# EAGLE board ESP32_BLDC_Motor_Driver (EAGLE 9.6.2)
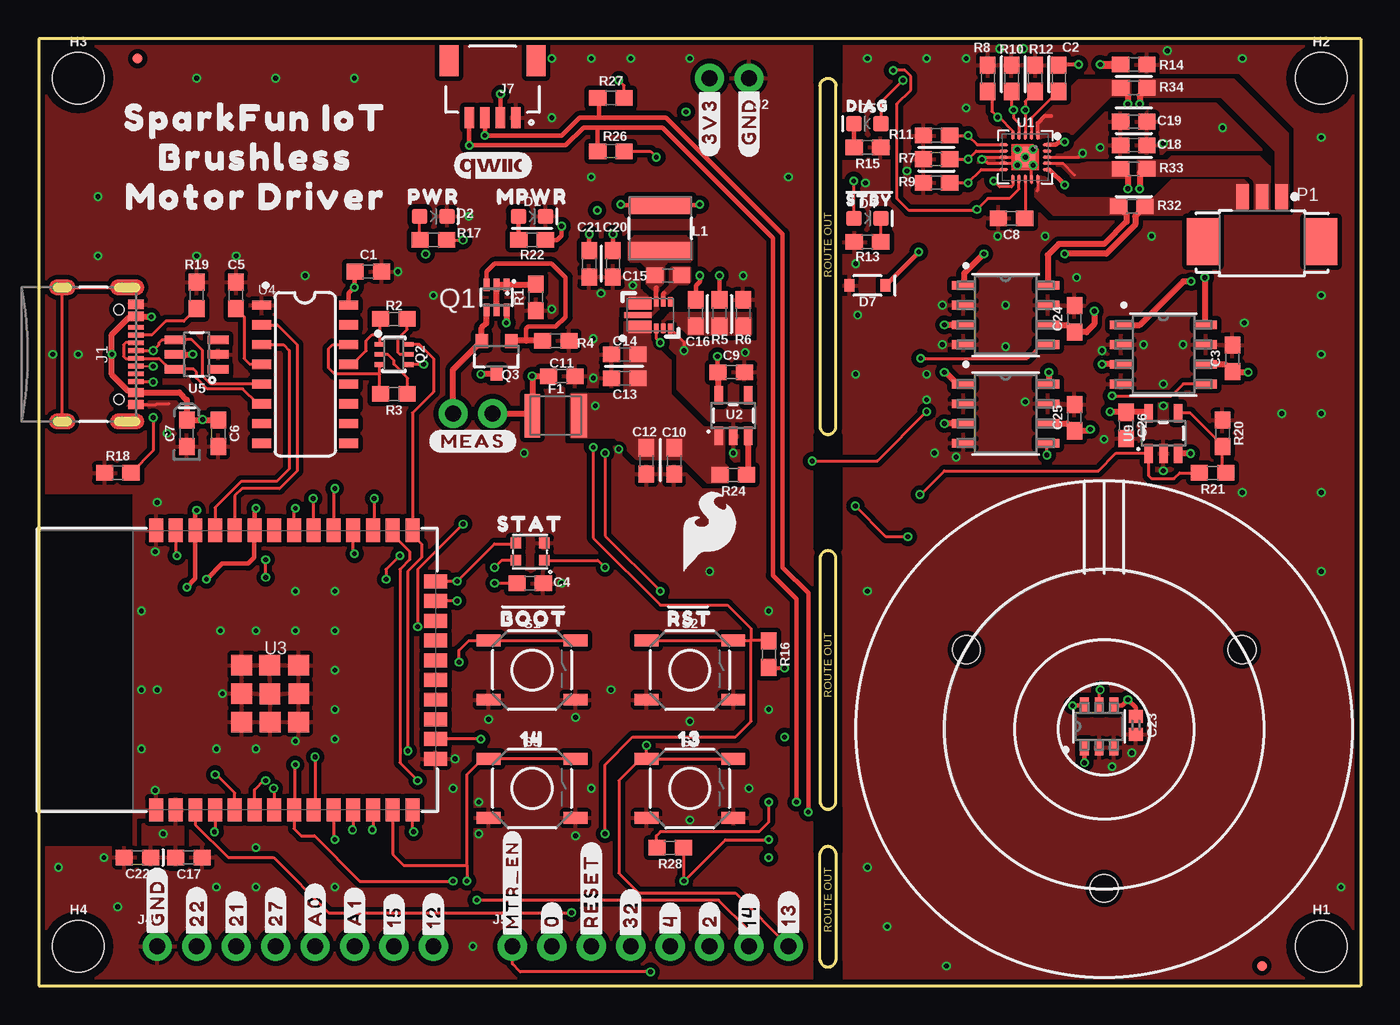
[diagram p1: board, top side]
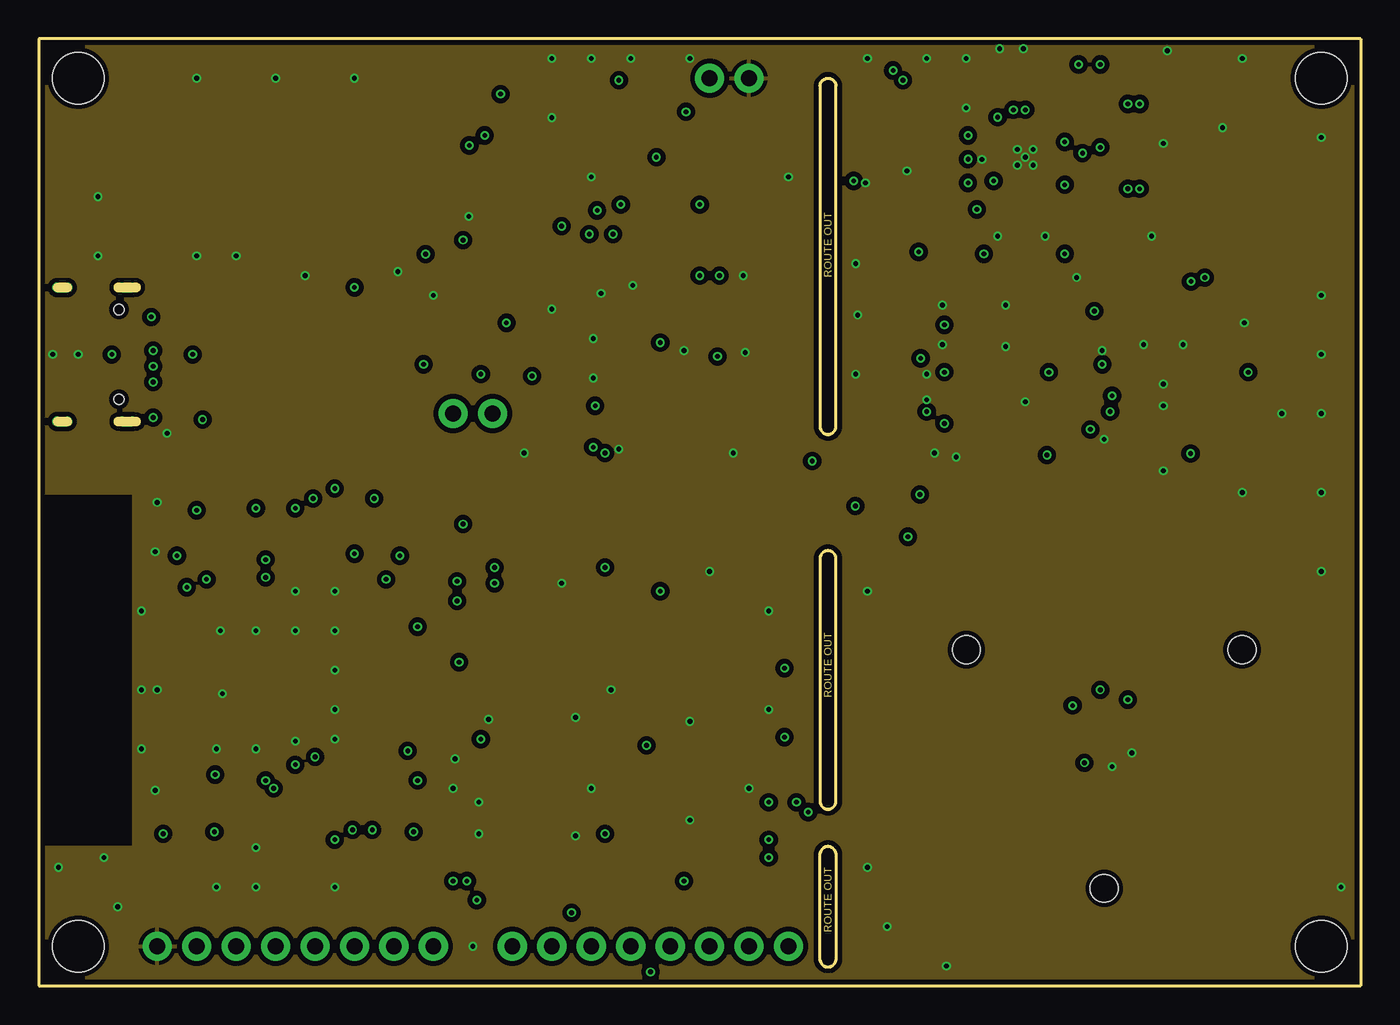
[diagram p2: board, inner layer Route2]
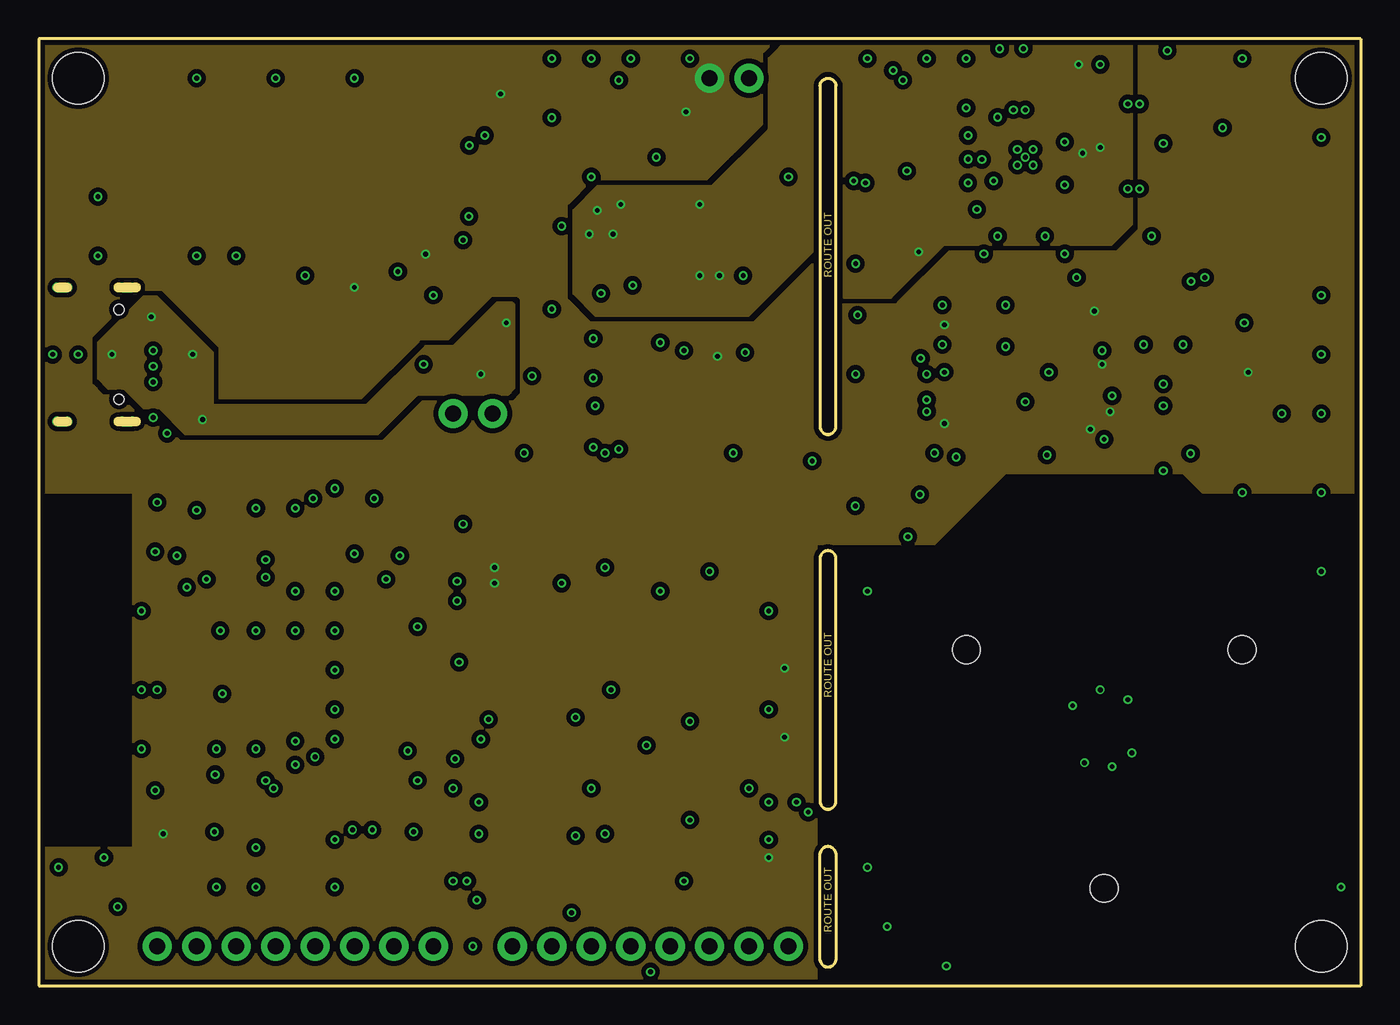
[diagram p3: board, inner layer Route15]
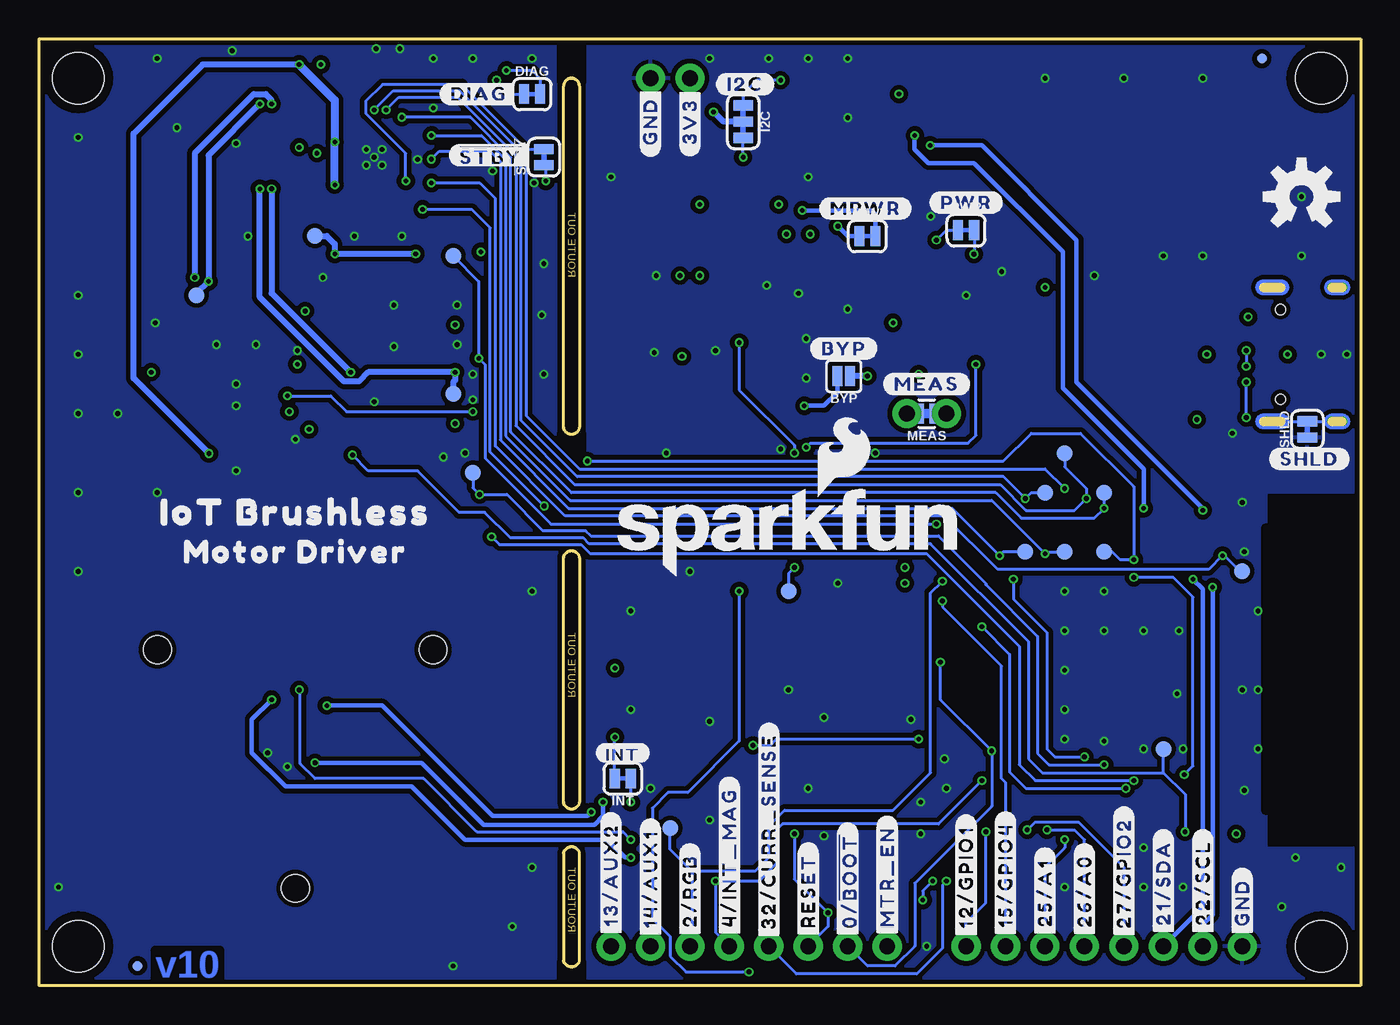
[diagram p4: board, bottom side, seen from below]

Size 85.09 x 60.96 mm. Coordinates in mm from the lower left corner, seen from the top.
Outline: 0,0 85.09,0 85.09,60.96 0,60.96 0,0
Outline: 50.29,57.91 50.29,35.94 arc166 51.31,35.94 51.31,57.91 arc180 50.29,57.91
Outline: 51.31,27.56 arc166 50.29,27.56 50.29,11.81 arc166 51.31,11.81 51.31,27.56
Outline: 51.31,8.51 arc166 50.29,8.51 50.29,1.65 arc166 51.31,1.65 51.31,8.51
Copper layers (1*2*15*16): Top 0.035559375mm / dielectric 0.47751875mm / Route2 0.035559375mm / dielectric 0.47751875mm / Route15 0.035559375mm / dielectric 0.47751875mm / Bottom 0.035559375mm
Design rules "SparkFun-4-Layer-Minimum-JLCPCB": minimum track width 5mil, minimum drill 0.2mm, track to track 5mil, track to pad 5mil, pad to pad 5mil, via to via 5mil, smd to smd 5mil, copper to edge 7mil, drill to drill 7mil, minimum pad ring 5mil, minimum via ring 5mil, stop-mask expansion 2.5mil, vias tented up to drill 25mil, thermal gap 10mil
tKeepout: area 0.1,11.3 to 6.1,29.3
tRestrict: area 50.2,58.2 to 51.4,60.6; area 50.2,8.6 to 51.4,11.4; area 50.2,0.3 to 51.4,1.5; area 50.2,34 to 51.4,35.4; area 50.2,28.2 to 51.4,33.4
bRestrict: area 0.1,11.3 to 6.1,29.5; area 50.2,58.2 to 51.4,60.6; area 50.2,0.3 to 51.4,1.5; area 50.2,34.9 to 51.4,35.6; area 50.2,34 to 50.7,34.9

## Footprints (pad centres in the part's own frame; a part is rotated, then mirrored left to right if it is on the bottom)
SMT-JUMPER_2_NC_TRACE_SILK = smd 0.66 x 1.27: 1 -0.521,0; 2 0.521,0
SMT-JUMPER_2_NO_SILK = smd 0.635 x 1.27: 1 -0.406,0; 2 0.406,0
0603 = smd 1.1 x 1: 1 -0.85,0; 2 0.85,0
0603-POLAR = smd 1.1 x 1: + 0.85,0; - -0.85,0
0402 = smd 0.85 x 0.9: 1 -0.58,0; 2 0.58,0
LED-0603 = smd 1 x 1: A -0.877,0; C 0.877,0
SOD-323 = smd 0.63 x 0.83: A 1.15,0; C -1.15,0
1210 = smd 1 x 2.8: 1 -1.5,0; 2 1.5,0
FIDUCIAL-MICRO = smd 0.635 x 0.635: 1 0,0
STAND-OFF = hole 3.302: 0,0
SMT-JUMPER_3_2-NC_TRACE_SILK = smd 0.66 x 1.27: 1 -1.041,0; 2 0,0; 3 1.041,0
USB-C-16P_4LAYER-PADS = smd 0.3 x 1: A5 -1.25,-0.34; A6 -0.25,-0.34; A7 0.25,-0.34; A8 1.25,-0.34; B5 1.75,-0.34; B6 0.75,-0.34; B7 -0.75,-0.34; B8 -1.75,-0.34 | smd 0.6 x 1: GND -3.225,-0.34; GND2 3.225,-0.34; VBUS1 -2.45,-0.34; VBUS2 2.45,-0.34 | drill 0.4 pad 0.6 long: SHLD1 -4.318,-0.915; SHLD2 4.318,-0.915; SHLD3 -4.318,-5.095; SHLD4 4.318,-5.095 | hole 0.65: -2.89,-1.445; 2.89,-1.445
1X02_NO_SILK = drill 1.016 pad 1.88: 1 0,0; 2 2.54,0
1X08_NO_SILK = drill 1.016 pad 1.88: 1 0,0; 2 2.54,0; 3 5.08,0; 4 7.62,0; 5 10.16,0; 6 12.7,0; 7 15.24,0; 8 17.78,0
JST04_1MM_RA = smd 0.6 x 1.35: 1 -1.5,0; 2 -0.5,0; 3 0.5,0; 4 1.5,0 | smd 1.2 x 2: NC1 2.8,-3.675; NC2 -2.8,-3.675
INDUCTOR_4X4MM = smd 4.089 x 1.143: P$1 0,1.473; P$2 0,-1.473
COMBO-JUMPER_2_NC_TRACE = smd 0.635 x 1.27: 1 -0.508,0; 2 0.508,0 | drill 1.016 pad 1.88: 3 -1.27,0; 4 1.27,0
MOLEX_0532610371 = smd 0.8 x 1.6: 1 1.25,0; 2 0,0; 3 -1.25,0 | smd 2.1 x 3: 4 -3.8,-2.9; 5 3.8,-2.9
SOT363_PHILIPS = smd 0.4 x 0.8: 1 -0.65,-0.8; 2 0,-0.8; 3 0.65,-0.8; 4 0.65,0.8; 5 0,0.8; 6 -0.65,0.8
SC70-6 = smd 0.3 x 0.66: 1 -0.65,-0.92; 2 0,-0.92; 3 0.65,-0.92; 4 0.65,0.92; 5 0,0.92; 6 -0.65,0.92
SOT23-3 = smd 0.8 x 0.9: 1 -0.95,-1; 2 0.95,-1; 3 0,1.1
TACTILE_SWITCH_SMD_5.2MM = smd 1.524 x 0.762: 1 -2.794,1.905; 2 2.794,1.905; 3 -2.794,-1.905; 4 2.794,-1.905
WS2812-2020 = smd 0.7 x 0.7: DI -0.915,0.55; DO 0.915,-0.55; GND 0.915,0.55; VCC -0.915,-0.55
PAD.03X.04 = smd 1.016 x 1.016: 1 0,0
QFN-20 = smd 0.6 x 0.2: 1 -1.4,0.8; 2 -1.4,0.4; 3 -1.4,0; 4 -1.4,-0.4; 5 -1.4,-0.8; 11 1.4,-0.8; 12 1.4,-0.4; 13 1.4,0; 14 1.4,0.4; 15 1.4,0.8 | smd 0.2 x 0.6: 6 -0.8,-1.4; 7 -0.4,-1.4; 8 0,-1.4; 9 0.4,-1.4; 10 0.8,-1.4; 16 0.8,1.4; 17 0.4,1.4; 18 0,1.4; 19 -0.4,1.4; 20 -0.8,1.4 | smd 1.27 x 1.27: PAD 0,0
SOT23-5 = smd 0.55 x 1.2: 1 -0.95,-1.3; 2 0,-1.3; 3 0.95,-1.3; 4 0.95,1.3; 5 -0.95,1.3
ESP-WROOM-32D = smd 0.9 x 1.5: 1 6.43,9; 2 5.16,9; 3 3.89,9; 4 2.62,9; 5 1.35,9; 6 0.08,9; 7 -1.19,9; 8 -2.46,9; 9 -3.73,9; 10 -5,9; 11 -6.27,9; 12 -7.54,9; 13 -8.81,9; 14 -10.08,9; 25 -10.08,-9; 26 -8.81,-9; 27 -7.54,-9; 28 -6.27,-9; 29 -5,-9; 30 -3.73,-9; 31 -2.46,-9; 32 -1.19,-9; 33 0.08,-9; 34 1.35,-9; 35 2.62,-9; 36 3.89,-9; 37 5.16,-9; 38 6.43,-9 | smd 1.5 x 0.9: 15 -11.57,5.715; 16 -11.57,4.445; 17 -11.57,3.175; 18 -11.57,1.905; 19 -11.57,0.635; 20 -11.57,-0.635; 21 -11.57,-1.905; 22 -11.57,-3.175; 23 -11.57,-4.445; 24 -11.57,-5.715 | smd 1.33 x 1.33: GND -0.912,1.531; GNDT1 -2.751,3.346; GNDT2 -2.761,1.516; GNDT3 -2.751,-0.314; GNDT4 -0.891,-0.324; GNDT5 0.909,-0.314; GNDT6 0.909,1.516; GNDT7 0.909,3.346; GNDT8 -0.921,3.346
SO016 = smd 0.6 x 1.2: 1 -4.445,-2.8; 2 -3.175,-2.8; 3 -1.905,-2.8; 4 -0.635,-2.8; 5 0.635,-2.8; 6 1.905,-2.8; 7 3.175,-2.8; 8 4.445,-2.8; 9 4.445,2.8; 10 3.175,2.8; 11 1.905,2.8; 12 0.635,2.8; 13 -0.635,2.8; 14 -1.905,2.8; 15 -3.175,2.8; 16 -4.445,2.8
SOT-23-6 = smd 0.55 x 1.35: 1 -0.95,-1.375; 2 0,-1.375; 3 0.95,-1.375; 4 0.95,1.375; 5 0,1.375; 6 -0.95,1.375
V-DFN3020-13 = smd 1.5 x 0.8: P$1 -0.675,-0.75; P$8 -0.675,0.75 | smd 0.3 x 0.6: P$2 0.375,-0.85; P$3 0.825,-0.85; P$4 1.275,-0.85; P$5 1.275,0.85; P$6 0.825,0.85; P$7 0.375,0.85 | smd 1.73 x 0.4: P$9 -0.79,0
D8_TEX = smd 1.46 x 0.559: 1 -2.724,1.905; 2 -2.724,0.635; 3 -2.724,-0.635; 4 -2.724,-1.905; 5 2.724,-1.905; 6 2.724,-0.635; 7 2.724,0.635; 8 2.724,1.905
SOT23-6_DBV_TEX = smd 0.978 x 0.559: 1 -1.365,0.95; 2 -1.365,0; 3 -1.365,-0.95; 4 1.365,-0.95; 5 1.365,0; 6 1.365,0.95
OT-EM3215 = hole 1.778: -8.877,5.125; 0,-10.25; 8.877,5.125

## Placement (x,y rotation side)
!STBY  JUMPER-SMT_2_NC_TRACE_SILK  [SMT-JUMPER_2_NC_TRACE_SILK]  52.58,53.34 90 bottom
BYP  JUMPER-SMT_2_NO_SILK  [SMT-JUMPER_2_NO_SILK]  33.27,39.24 180 bottom
C1  0.1uF  [0603]  21.21,45.97 0 top
C2  0.1uF  [0603]  65.66,58.42 270 top
C3  0.1uF  [0603]  76.83,40.39 90 top
C4  0.1uF  [0603]  31.62,25.91 0 top
C5  10nF  [0603]  12.7,44.45 90 top
C6  0.1uF  [0603]  11.56,35.56 270 top
C7  10uF  [0603-POLAR]  9.53,35.56 90 top
C8  0.1uF  [0603]  62.61,49.4 180 top
C9  2.2uF  [0603]  44.58,39.5 0 top
C10  1.0uF  [0603]  40.89,33.78 270 top
C11  0.1uF  [0603]  33.66,39.24 0 top
C12  0.1uF  [0603]  39.12,33.78 270 top
C13  10uF  [0603]  37.72,39.12 180 top
C14  10uF  [0603]  37.72,40.64 180 top
C15  0.1uF  [0603]  40.51,45.72 180 top
C16  33pF  [0603]  42.29,43.31 90 top
C17  0.1uF  [0603]  9.65,8.26 0 top
C18  10uF  [0603]  70.48,54.1 0 top
C19  0.1uF  [0603]  70.48,55.63 0 top
C20  22uF  [0603]  36.96,46.48 270 top
C21  22uF  [0603]  35.43,46.48 270 top
C22  22uF  [0603]  6.35,8.26 180 top
C23  0.1uF  [0402]  70.61,16.76 270 top
C24  0.1uF  [0603]  66.67,42.93 90 top
C25  0.1uF  [0603]  66.67,36.58 90 top
C26  0.1uF  [0603]  69.98,36.07 270 top
D1  RED  [LED-0603]  31.75,49.53 0 top
D2  RED  [LED-0603]  25.4,49.53 0 top
D4  BLUE  [LED-0603]  53.34,49.4 0 top
D5  GREEN  [LED-0603]  53.34,55.5 180 top
D7  3.3V  [SOD-323]  53.34,45.09 180 top
DIAG  JUMPER-SMT_2_NC_TRACE_SILK  [SMT-JUMPER_2_NC_TRACE_SILK]  53.34,57.4 0 bottom
F1  6V/2A  [1210]  33.27,36.7 0 top
FD1  FIDUCIALUFIDUCIAL  [FIDUCIAL-MICRO]  78.74,1.27 0 bottom
FD2  FIDUCIALUFIDUCIAL  [FIDUCIAL-MICRO]  78.74,1.27 0 top
FD3  FIDUCIALUFIDUCIAL  [FIDUCIAL-MICRO]  6.35,59.69 0 bottom
FD4  FIDUCIALUFIDUCIAL  [FIDUCIAL-MICRO]  6.35,59.69 0 top
FRAME1  FRAME-LEDGER  [CREATIVE_COMMONS]  19.05,-90.17 0 top  (outside the outline)
H1  STAND-OFF  [STAND-OFF]  82.55,2.54 0 top
H2  STAND-OFF  [STAND-OFF]  82.55,58.42 0 top
H3  STAND-OFF  [STAND-OFF]  2.54,58.42 0 top
H4  STAND-OFF  [STAND-OFF]  2.54,2.54 0 top
I2C  JUMPER-SMT_3_2-NC_TRACE_SILK  [SMT-JUMPER_3_2-NC_TRACE_SILK]  39.75,55.63 270 bottom
INT  JUMPER-SMT_2_NC_TRACE_SILK  [SMT-JUMPER_2_NC_TRACE_SILK]  47.5,13.34 180 bottom
J1  USB-C Connector  [USB-C-16P_4LAYER-PADS]  6.6,40.64 270 top
J2  [1X02_NO_SILK]  45.72,58.42 180 top
J4  Breadboard Connector  [1X08_NO_SILK]  7.62,2.54 0 top
J5  Breadboard Headers  [1X08_NO_SILK]  30.48,2.54 0 top
J7  QWIIC_RIGHT_ANGLE  [JST04_1MM_RA]  29.21,55.88 180 top
L1  4.7μH  [INDUCTOR_4X4MM]  40.01,48.77 180 top
LOGO1  SFE_LOGO_NAMEBLANK  [BLANK]  102.87,3.81 0 bottom  (outside the outline)
LOGO2  OSHW-LOGOM  [OSHW-LOGO-M]  3.81,50.8 0 bottom
LOGO3  SFE_LOGO_FLAME.2_INCH  [SFE_LOGO_FLAME_.2]  43.18,29.21 0 top
LOGO4  QWIIC_LOGO_5MM  [QWIIC_5MM]  29.21,52.83 0 top
MEAS  JUMPER-COMBO_2_NC_TRACE  [COMBO-JUMPER_2_NC_TRACE]  27.94,36.83 180 bottom
MPWR  JUMPER-SMT_2_NC_TRACE_SILK  [SMT-JUMPER_2_NC_TRACE_SILK]  31.75,48.26 0 bottom
P1  0532610371  [MOLEX_0532610371]  78.74,50.8 0 top
PWR  JUMPER-SMT_2_NC_TRACE_SILK  [SMT-JUMPER_2_NC_TRACE_SILK]  25.4,48.64 0 bottom
Q1  [SOT363_PHILIPS]  29.46,44.32 180 top
Q2  NPN Transistors  [SC70-6]  22.86,40.64 270 top
Q3  20V/4.2A/52mΩ/1.4W  [SOT23-3]  29.46,40.51 180 top
R1  100k  [0603]  32,44.32 90 top
R2  10k  [0603]  22.86,42.93 180 top
R3  10k  [0603]  22.86,38.1 180 top
R4  1M  [0603]  33.27,41.53 180 top
R5  93.1k  [0603]  43.81,43.31 90 top
R6  30.1k  [0603]  45.34,43.31 270 top
R7  100k  [0603]  57.78,53.21 0 top
R8  100k  [0603]  61.09,58.42 270 top
R9  100k  [0603]  57.78,51.69 0 top
R10  100k  [0603]  62.61,58.42 270 top
R11  100k  [0603]  57.78,54.74 0 top
R12  100k  [0603]  64.14,58.42 270 top
R13  2.2k  [0603]  53.34,47.88 0 top
R14  0.012ohm  [0603]  70.48,59.31 180 top
R15  330  [0603]  53.34,53.98 180 top
R16  10k  [0603]  46.99,21.34 270 top
R17  4.7k  [0603]  25.4,48.01 0 top
R18  5.1k  [0603]  5.08,33.02 0 top
R19  5.1k  [0603]  10.16,44.45 270 top
R20  1k  [0603]  76.2,35.56 270 top
R21  20k  [0603]  75.56,33.02 180 top
R22  4.7k  [0603]  31.75,48.01 0 top
R24  100k  [0603]  44.7,32.89 180 top
R26  2.2k  [0603]  36.83,53.72 0 top
R27  2.2k  [0603]  36.83,57.15 0 top
R28  10k  [0603]  40.64,8.89 180 top
R32  0.012ohm  [0603]  70.36,50.16 0 top
R33  0.012ohm  [0603]  70.48,52.58 0 top
R34  0.012ohm  [0603]  70.48,57.78 0 top
S1  [TACTILE_SWITCH_SMD_5.2MM]  31.75,20.32 0 top
S2  [TACTILE_SWITCH_SMD_5.2MM]  41.91,20.32 0 top
S3  [TACTILE_SWITCH_SMD_5.2MM]  31.75,12.7 0 top
S4  [TACTILE_SWITCH_SMD_5.2MM]  41.91,12.7 0 top
SHLD  JUMPER-SMT_2_NC_TRACE_SILK  [SMT-JUMPER_2_NC_TRACE_SILK]  3.43,35.81 90 bottom
STAT  WS2812_2020  [WS2812-2020]  31.62,27.94 0 top
TP1  TEST-POINT3X4  [PAD.03X.04]  44.45,10.16 0 bottom
TP2  TEST-POINT3X4  [PAD.03X.04]  36.83,25.4 90 bottom
TP3  TEST-POINT3X4  [PAD.03X.04]  20.32,31.75 0 bottom
TP4  TEST-POINT3X4  [PAD.03X.04]  19.05,27.94 0 bottom
TP5  TEST-POINT3X4  [PAD.03X.04]  19.05,34.29 0 bottom
TP6  TEST-POINT3X4  [PAD.03X.04]  7.62,26.67 0 bottom
TP7  TEST-POINT3X4  [PAD.03X.04]  16.51,31.75 0 bottom
TP8  TEST-POINT3X4  [PAD.03X.04]  21.59,27.94 0 bottom
TP9  TEST-POINT3X4  [PAD.03X.04]  57.15,33.02 270 bottom
TP10  TEST-POINT3X4  [PAD.03X.04]  58.42,46.99 0 bottom
TP11  TEST-POINT3X4  [PAD.03X.04]  12.7,15.24 0 bottom
TP12  TEST-POINT3X4  [PAD.03X.04]  16.51,27.94 0 bottom
TP13  TEST-POINT3X4  [PAD.03X.04]  67.31,48.26 0 bottom
TP14  TEST-POINT3X4  [PAD.03X.04]  58.42,38.1 0 bottom
TP15  TEST-POINT3X4  [PAD.03X.04]  74.93,44.45 0 bottom
U1  TMC6300  [QFN-20]  63.5,53.34 270 top
U2  3.3V  [SOT23-5]  44.7,36.7 0 top
U3  ESP-WROOM-3232D  [ESP-WROOM-32D]  13.97,20.32 180 top
U4  CH340C  [SO016]  17.14,39.37 270 top
U5  ESD Diode  [SOT-23-6]  10.16,40.64 90 top
U6  AP63357  [V-DFN3020-13]  39.37,43.18 0 top
U7  INA240A1  [D8_TEX]  62.23,43.18 0 top
U8  TMAG5273  [SOT23-6_DBV_TEX]  68.26,16.69 90 top
U9  MCP6021T  [SOT23-5]  72.39,35.56 0 top
U10  INA240A1  [D8_TEX]  72.39,40.64 0 top
U11  INA240A1  [D8_TEX]  62.23,36.83 0 top
U$1  [ORDERING_INSTRUCTIONS]  102.87,54.61 0 top  (outside the outline)
U$2  [OT-EM3215]  68.58,16.51 0 top
U$3  [1436]  31.75,15.88 0 top
U$4  [STAT1630063003522]  31.62,29.72 0 top
U$5  [RST1630063003525]  41.91,23.62 0 top
U$6  [#14#AUX1#36]  45.72,6.86 90 bottom
U$7  [#12#31]  25.4,4.45 90 top
U$8  [#DIAG#15]  56.77,57.4 0 bottom
U$9  [#14#36]  45.72,4.45 90 top
U$10  [##STBY##16]  56.01,53.47 0 bottom
U$11  [BOOT21630063003532]  31.88,23.62 0 top
U$12  [PWR21630063003533]  25.4,50.8 0 top
U$13  [#MTR_EN#131458]  30.48,6.99 90 bottom
U$14  [#GND#32]  7.62,5.33 90 top
U$15  [#GND#32]  7.62,5.33 90 bottom
U$16  [#3V3#18]  43.18,55.63 90 bottom
U$17  [#4#INT_MAG#21630063003534]  40.64,8.26 90 bottom
U$18  [#22#33]  10.16,4.7 90 top
U$19  [#21#33]  12.7,4.57 90 top
U$20  [#MPWR#131468]  31.88,50.04 0 bottom
U$21  [#27#33]  15.24,4.7 90 top
U$22  [#15#33]  22.86,4.45 90 top
U$23  [#I2C#630063003467]  39.62,58.04 0 bottom
U$24  [#SHLD#630063003467]  3.3,33.91 0 bottom
U$25  [##INT#630063003473]  47.5,14.99 0 bottom
U$26  [#32#CURR_SENSE#10]  38.1,9.91 90 bottom
U$27  [#PWR#33]  25.4,50.42 0 bottom
U$28  [#GND#17]  45.72,55.63 90 top
U$29  [#RESET#34]  35.56,6.1 90 top
U$30  [#RESET#34]  35.56,6.1 90 bottom
U$31  [#0#33]  33.02,4.19 90 top
U$32  [#0##BOOT##0]  33.02,6.73 90 bottom
U$33  [#32#33]  38.1,4.57 90 top
U$34  [#4#33]  40.64,4.19 90 top
U$35  [#12#GPIO1#4]  25.4,6.99 90 bottom
U$36  [#2#33]  43.18,4.19 90 top
U$37  [#15#GPIO4#13]  22.86,7.11 90 bottom
U$38  [#13#36]  48.26,4.57 90 top
U$39  [131437]  41.91,15.88 0 top
U$40  [#26#A0#30]  17.78,6.1 90 bottom
U$41  [#25#A1#30]  20.32,5.97 90 bottom
U$42  [#A1#30]  20.32,4.7 90 top
U$43  [#BYP#131439]  33.27,41.02 0 bottom
U$44  [SPARKFUN_IOT131442]  13.97,55.88 0 top
U$45  [SFE_LOGO_NAME_FLAME_.2]  36.83,29.21 0 bottom
U$46  [BRUSHLESS131445]  13.97,53.34 0 top
U$47  [MOTOR_DRIVER131446]  13.97,50.8 0 top
U$48  [#MEAS#131453]  27.94,35.05 0 top
U$49  [MPWR131449]  31.75,50.8 0 top
U$50  [#MEAS#131453]  27.94,38.73 0 bottom
U$51  [#MTR_EN#131460]  30.48,6.48 90 top
U$52  [#13#AUX2#14]  48.26,7.11 90 bottom
U$53  [#STBY#131470]  53.47,50.67 0 top
U$54  [#27#GPIO2#27]  15.24,7.24 90 bottom
U$55  [IOT_BRUSHLESS131454]  68.58,30.48 0 bottom
U$56  [#21#SDA#29]  12.7,6.6 90 bottom
U$57  [DIAG131469]  53.34,56.64 0 top
U$58  [#3V3#18]  43.18,55.63 90 top
U$59  [#2#RGB#18]  43.18,6.1 90 bottom
U$60  [#GND#17]  45.72,55.63 90 bottom
U$62  [MOTOR_DRIVER630063003515]  68.58,27.94 0 bottom
U$63  [#22#SCL#30]  10.16,6.6 90 bottom
U$64  [#A0#30]  17.78,4.83 90 top

## Tracks (layer width: path | path; a pad name or v marks a point on that pad's centre or on a via)
1.8_VOUT
  Top 0.203: U1.13 63.5,49.44 C8.1
3.3V  (via drill 0.3)
  Top 0.203: v29.71,57.4 v29.72,57.4 | C4.1 v29.34,25.91 | STAT.VCC 29.8,27.39 v29.34,26.92
  Top 0.254: R16.2 47.03,20.45 v48.01,20.45
  Top 0.305: C23.1 70.61,17.91 v70.1,18.41 69.75,18.06 U8.4 | J7.2 v29.71,57.4 | U4.16 19.95,44.58 v20.32,44.96 20.32,45.94 C1.1 | C9.1 43.69,39.54 v43.69,40.51
  Top 0.381: U2.5 43.75,39.47 C9.1 | U7.6 66.21,42.55 C24.1 67.44,42.08 67.94,42.58 v67.94,43.43 | U10.3 v68.45,40.01 | U7.3 v58.29,42.55 | U11.3 v58.29,36.2 | v68.96,36.96 69,36.92 C26.1 71.38,36.92 U9.5 | U11.6 66.21,36.2 C25.1 67.6,35.73 v67.69,35.81 | U10.6 76.37,40.01 C3.1 76.87,39.5 v77.85,39.5
  Bottom 0.203: INT.2 v48.02,15.99 v48.01,16 | PWR.2 24.88,47.11 v24.89,47.1
  Bottom 0.305: v70.1,18.41 71.37,17.14 71.37,14.99 69.22,12.83 61.09,12.83 57.66,9.4 48.51,9.4 47.37,8.26 v46.99,8.26
  Bottom 0.381: I2C.2 41.02,55.63 v41.66,56.26
  other vias: 8,9.78
  pour Route15 (isolate 0.305, rank 2): 0,60.96 0,30.99 0,9.14 0,0
  pour Top (isolate 0.305): 8.38,12.06 9.27,12.06 9.27,7.75 6.73,7.75 6.73,10.41 8.38,10.41
  pour Route15 (isolate 0.305, rank 2): 0,60.96 38.1,60.96 85.09,60.96
  pour Route15 (isolate 0.305, rank 3, no thermals): 0,8.89 6.1,8.89 6.1,31.75 0,31.75 0,60.96 85.09,60.96 85.09,31.75 74.93,31.75 73.66,33.02 62.23,33.02 60.96,31.75 57.66,28.45 51.82,28.45 50.04,28.45 50.04,0 0,0
3.3V_A  (via drill 0.3)
  Top 0.203: v67.18,53.59 66.93,53.34 U1.18
  Top 0.254: v66.93,59.31 65.7,59.31 C2.1
  Top 0.305: D7.C v56.64,47.24 | C21.1 v35.43,48.39 | C20.1 v36.96,48.39 | v42.55,50.29 42.49,50.24 L1.P$2 37.52,50.24 v37.47,50.29 | C16.2 42.29,45.09 42.55,45.34 v42.55,45.72 | R5.2 v43.81,45.72
  Bottom 0.305: MPWR.2 31.23,49.64 31.5,49.91 v35.94,49.91
  other vias: 68.33,53.98
  pour Top (isolate 0.305): 64.64,53.47 64.64,53.34 70.15,53.34 70.15,56.18 68.63,56.18 65.91,53.47
  pour Route15 (isolate 0.305, no thermals): 35.81,43.18 45.72,43.18 49.91,47.37 49.91,58.29 50.29,58.67 51.31,58.67 51.82,58.17 51.82,44.32 54.86,44.32 58.29,47.75 69.09,47.75 70.36,49.02 70.36,60.96 48.26,60.96 46.99,59.69 46.99,55.12 43.31,51.44 35.94,51.44 34.42,49.91 34.42,44.58
5V  (via drill 0.3)
  Bottom 0.305: BYP.2 33.68,38.2 34.54,37.34 v35.81,37.34
  pour Top (isolate 0.203, rank 2, no thermals): 34.29,38.1 37.72,38.1 37.72,42.8 39.37,42.8 39.37,41.53 40.64,40.26 40.64,38.1 42.8,35.94 44.07,35.94 44.07,33.66 44.32,33.4 44.32,32.38 43.05,32.38 41.53,33.91 38.48,33.91 37.08,35.31 34.29,35.31
5V_MEAS
  Top 0.381: Q1.4 28.81,42.66 28.51,42.36 Q3.2 26.66,39.66 26.66,36.84 MEAS.3
  Bottom 0.381: MEAS.3 MEAS.1
!RESET  (via drill 0.3)
  Top 0.203: U3.3 10.08,10.37 12.19,8.26 15.11,8.26 18.69,4.67 34.19,4.67 34.21,4.7 v34.29,4.7 | R16.1 46.95,22.23 45.85,22.23 | S2.1 S2.2 45.85,22.23 | v24.77,40.01 24.75,39.99 Q2.4 | 45.85,22.23 45.85,17.02 44.83,16 38.23,16 36.45,14.22 v36.45,9.78 | 45.85,22.23 45.85,22.99 44.32,24.51 40.01,24.51 35.69,28.83 v35.69,34.67
  Bottom 0.203: v35.69,34.67 35.43,34.92 25.27,34.92 24.77,35.43 v24.77,40.01 | v36.45,9.78 36.45,6.86 v34.29,4.7 34.29,3.81 J5.3
BST
  Top 0.305: U6.P$6 40.2,44.51 40.26,44.58
  pour Top (isolate 0.152, rank 2, no thermals): 40.13,44.32 40.13,43.81 40.26,43.81 40.26,44.32 40.39,44.45 41.15,45.21 41.78,45.21 41.91,45.34 41.91,46.1 41.91,46.23 40.89,46.23 40.77,46.23 40.64,46.1 40.64,45.47 40.64,45.09 40.51,44.96 40.13,44.58
CH340-RX
  Top 0.203: U4.3 15.75,41.27 16.13,40.89 16.13,33.27 15.32,32.46 13.03,32.46 11.35,30.78 U3.35
CH340-TX
  Top 0.203: U4.2 15.37,42.55 16.64,41.27 16.64,33.15 15.49,32 13.08,32 12.62,31.54 U3.34
D  (via drill 0.3)
  Top 0.203: v55.63,58.29 55.61,58.29 54.22,56.9 D5.A
  Bottom 0.203: v55.63,58.29 54.74,57.4 DIAG.1
D+  (via drill 0.3)
  Top 0.131: J1.B6 7.35,39.89 v7.37,39.88
  Top 0.183: J1.A6 v7.37,40.89 7.75,41.27 7.75,41.4 7.93,41.59 U5.4 9.85,41.59 10.54,40.89 10.54,39.26 11.07,38.73 U4.5
  Bottom 0.183: v7.37,40.89 v7.37,39.88
D-
  Top 0.131: 8.64,39.69 8.76,39.69 U5.6
  Top 0.183: J1.B7 5.58,41.39 5.46,41.27 5.46,40.51 5.59,40.39 J1.A7 7.74,40.39 8.44,39.69 8.64,39.69 | U4.6 14.1,37.47 13.14,38.42 10.85,38.42 10.16,39.12 10.16,39.5 9.97,39.69 8.76,39.69
DTR
  Top 0.203: R2.2 21.94,42.86 21.94,41.91 | 21.94,41.91 Q2.1 | U4.13 20.2,40.01 21.08,40.89 21.08,41.53 21.46,41.91 21.94,41.91
ESP_0/QPWR  (via drill 0.3)
  Top 0.203: Q2.6 24.5,41.29 25.4,40.39 25.4,38.23 24.05,36.88 U3.25 24.05,29.04 24.64,28.45 24.64,27.56 23.75,26.67 v23.75,15.11 | v27.05,20.83 27.05,21.59 27.69,22.23 S1.1 S1.2
  Bottom 0.203: J5.2 31.75,1.27 29.97,1.27 28.7,2.54 28.7,6.6 23.75,11.56 v23.75,15.11 27.05,18.41 v27.05,20.83
ESP_2/RGB_DI  (via drill 0.3)
  Top 0.203: STAT.DI 30.67,28.45 29.34,28.45 v26.92,26.04 U3.24
  Bottom 0.203: 43.05,7.37 43.05,2.67 J5.6 | v26.92,26.04 27.69,25.27 27.69,13.72 30.1,11.3 37.08,11.3 38.1,10.29 38.1,8.26 38.99,7.37 43.05,7.37 | 43.05,7.37 44.45,8.76 TP1.1
ESP_4/!INT_MAG  (via drill 0.3)
  Top 0.203: R28.1 41.49,6.77 v41.53,6.73 44.2,9.4 v46.99,9.4 | U3.26 22.78,29.04 23.88,27.94 23.88,27.43 23.24,26.8 23.24,14.35 v24.38,13.21 | U8.5 68.25,18.98 v68.33,19.05
  Bottom 0.203: J5.5 41.53,3.43 v41.53,6.73 38.73,6.73 37.59,7.87 37.59,10.03 37.21,10.41 27.18,10.41 v24.38,13.21 | v68.33,19.05 68.26,18.99 68.26,14.29 67.31,13.34 60.33,13.34 56.9,9.91 47.5,9.91 v46.99,9.4
ESP_5/!STDBY  (via drill 0.3)
  Top 0.203: U1.11 62.7,51.52 62.61,51.44 61.85,51.44 v61.47,51.82 | v19.05,32 18.97,31.92 U3.29
  Bottom 0.203: v61.47,51.82 61.47,53.59 64.01,56.13 64.01,56.98 62.97,58.02 57.89,58.02 53.72,53.85 | v19.05,32 20.32,33.27 50.29,33.27 53.72,36.7 53.72,53.85 | 53.72,53.85 53.72,53.86 !STBY.2
ESP_12/GPIO1  (via drill 0.3)
  Top 0.203: v24.13,9.91 24.05,9.99 U3.14
  Bottom 0.203: v24.13,9.91 24.13,5.33 25.4,4.06 J4.8
ESP_13/AUX2  (via drill 0.3)
  Top 0.203: S4.1 S4.2 | S4.1 38.73,14.61 37.34,13.21 37.34,7.24 38.61,5.97 44.83,5.97 J5.8 | S4.1 v39.12,15.47 | v28.45,15.88 U3.16
  Bottom 0.203: v39.12,15.47 38,15.47 37.59,15.88 v28.45,15.88
ESP_14/AUX1  (via drill 0.3)
  Top 0.203: S3.2 S3.1 28.57,14.61 27.56,13.59 27.56,7.75 | J5.7 45.72,3.56 43.76,5.51 v28.19,5.51 | 27.56,7.75 v27.56,6.73 | U3.13 22.78,8.46 23.5,7.75 27.56,7.75
  Bottom 0.203: v27.56,6.73 28.19,6.1 v28.19,5.51
ESP_15/GPIO4  (via drill 0.3)
  Top 0.203: v26.92,24.77 U3.23
  Bottom 0.203: J4.7 22.86,13.08 23.11,13.34 23.11,20.57 26.92,24.38 v26.92,24.77
ESP_16/UH  (via drill 0.3)
  Top 0.203: R12.2 63.5,56.94 v63.5,56.39 U1.3 | v21.59,31.37 21.59,29.4 U3.27
  Bottom 0.203: v63.5,56.39 62.28,57.61 58,57.61 54.05,53.66 54.05,36.39 50.43,32.77 22.99,32.77 v21.59,31.37 21.21,31.75 TP3.1
ESP_17/UL  (via drill 0.3)
  Top 0.203: R11.2 v59.82,54.74 60.41,54.14 U1.6 | v20.32,27.81 20.24,27.89 U3.28
  Bottom 0.203: v59.82,54.74 56.6,54.74 55.04,53.17 55.04,35.39 50.89,31.24 23.75,31.24 20.38,27.88 | 20.38,27.88 v20.32,27.81 | TP4.1 19.11,27.88 20.38,27.88
ESP_18/VH  (via drill 0.3)
  Top 0.203: R10.2 62.61,56.52 v62.74,56.39 62.74,55.88 63.1,55.52 U1.4 | v17.65,31.37 17.65,29.37 U3.30
  Bottom 0.203: v62.74,56.39 61.92,57.2 58.13,57.2 54.38,53.45 54.38,36.05 50.59,32.26 23.2,32.26 21.55,30.61 18.41,30.61 v17.65,31.37 17.65,32 19.05,33.4 TP5.1
ESP_19/WH  (via drill 0.3)
  Top 0.203: R8.2 61.34,57.32 61.34,56.29 v61.72,55.91 61.82,55.91 62.7,55.03 U1.5 | v16.51,30.73 16.53,30.71 16.43,30.61 U3.31
  Bottom 0.203: v61.72,55.91 57.31,55.91 54.71,53.31 54.71,35.66 50.8,31.75 23.5,31.75 21.84,30.1 17.14,30.1 v16.51,30.73 TP7.1
ESP_21/TP_SDA  (via drill 0.3)
  Top 0.203: 66.57,18.06 v66.55,18.03 | 13.89,30.65 v13.97,30.73 | 49.53,11.43 v49.53,11.18
  Top 0.305: U8.6 66.57,18.06 | 13.89,30.65 U3.33 13.86,29.29 13.86,27.57 13.47,27.18 11.81,27.18 v10.79,26.16 | 49.53,11.43 49.53,25.27 47.88,26.92 47.88,48.39 40.39,55.88 36.07,55.88 | J7.3 v28.71,54.74 v28.7,54.74 33.66,54.74 34.8,55.88 36.07,55.88 | R27.1 36.07,57.06 36.07,55.88
  Bottom 0.305: v13.97,30.73 13.97,33.27 19.18,38.48 19.18,47.24 24.89,52.96 27.81,52.96 28.71,53.86 28.71,54.73 v28.7,54.74 | v49.53,11.18 49.78,10.92 55.88,10.92 62.99,18.03 v66.55,18.03 | v10.79,26.16 10.16,25.53 10.16,5.08 J4.3
ESP_22/TP_SCL  (via drill 0.3)
  Top 0.203: U8.1 | 10.08,30.53 v10.16,30.61
  Top 0.305: U8.1 v67.31,14.35 | J7.4 v27.71,54.1 33.91,54.1 35.05,55.24 35.94,55.24 | 10.08,30.53 U3.36 10.08,26.21 v9.53,25.65 | v48.77,11.81 48.77,24.89 47.24,26.42 47.24,48.13 40.13,55.24 35.94,55.24 | R26.1 35.98,55.21 35.94,55.24
  Bottom 0.305: v27.71,54.1 24.38,54.1 18.29,48.01 18.29,38.86 10.16,30.73 v10.16,30.61 | v67.31,14.35 60.45,14.35 56.46,10.36 49.33,10.36 48.77,10.92 v48.77,11.81 | J4.2 10.16,3.94 9.53,4.57 v9.53,25.65
ESP_23/VL  (via drill 0.3)
  Top 0.203: R9.2 v59.82,51.69 60.67,52.54 U1.10 | U3.37 8.81,27.77 v8.89,27.69
  Bottom 0.203: v59.82,51.69 56.72,51.69 55.7,50.67 55.7,34.74 51.21,30.25 26.82,30.25 23.37,26.8 9.78,26.8 v8.89,27.69 8.76,27.69 7.75,26.67 TP6.1
ESP_25/TP_A1  (via drill 0.3)
  Top 0.203: U3.10 18.97,9.48 v19.05,9.4
  Bottom 0.203: v19.05,9.4 19.05,8.89 20.32,7.62 J4.6
ESP_26/TP_A0  (via drill 0.3)
  Top 0.203: U3.11 20.24,10.08 v20.19,10.03
  Bottom 0.203: v20.19,10.03 18.41,10.03 17.78,9.4 J4.5
ESP_27/GPIO2  (via drill 0.3)
  Top 0.203: U3.12 21.51,10.08 v21.46,10.03
  Bottom 0.203: v21.46,10.03 20.95,10.54 18.16,10.54 15.24,7.62 15.24,6.35 15.24,5.71 J4.4
ESP_32/CURR_SENSE  (via drill 0.3)
  Top 0.203: v16.51,14.22 16.51,11.4 U3.8 16.43,10.11 16.89,9.65 17.74,9.65 20.66,6.73 v26.67,6.73 | v56.72,31.62 56.77,31.62 58.29,33.15 68.2,33.15 69.34,34.29 71.25,34.29 | R21.2 73.44,33.02 73.06,32.64 71.63,32.64 71.44,32.83 U9.1 71.28,34.26 71.25,34.29 | 71.25,34.29 71.41,34.29
  Bottom 0.203: v16.51,14.22 20.07,14.22 20.8,14.96 20.8,22.5 24.13,25.83 24.13,25.91 27.18,28.96 49.55,28.96 49.88,29.29 52.62,29.29 54.96,31.62 v56.72,31.62 57.15,32.05 TP9.1 | v26.67,6.73 26.92,6.48 26.92,2.41 28.57,0.76 36.32,0.76 J5.4
ESP_33/WL  (via drill 0.3)
  Top 0.203: R7.2 v59.82,53.21 60.34,53.74 U1.7 | v23.24,27.69 22.35,26.8 v22.35,26.16 | v17.78,14.73 17.78,11.4 U3.9
  Bottom 0.203: v59.82,53.21 59.31,53.72 56.06,53.72 55.37,53.04 55.37,35.13 50.98,30.73 26.29,30.73 v23.24,27.69 22.99,27.94 TP8.1 | v22.35,26.16 22.35,24.89 20.19,22.73 20.19,15.24 19.68,14.73 v17.78,14.73
ESP_34/DIAG  (via drill 0.3)
  Top 0.203: U1.12 63.1,51.29 62.48,50.67 61.09,50.67 v60.39,49.97 60.33,49.91 56.01,49.91 55.24,50.67 55.24,56.77 56.13,57.66 56.13,58.55 55.75,58.93 v54.99,58.93 | U3.6 13.89,12.62 14.48,13.21 v14.61,13.21 | v55.95,28.9 54.54,28.9 v52.56,30.88
  Bottom 0.203: v14.61,13.21 20.95,13.21 21.97,14.22 21.97,21.84 27.94,27.81 49.6,27.81 50.18,28.39 55.44,28.39 v55.95,28.9 | v54.99,58.93 53.34,58.93 52.82,58.41 DIAG.2 | v52.56,30.88 56.03,34.35 56.03,48.79 57.21,49.97 v60.39,49.97
ESP_35/U_OUT  (via drill 0.3)
  Top 0.203: v27.3,29.72 24.38,26.8 v24.38,23.11 | v15.11,12.7 15.16,12.65 U3.7 | v24.38,23.11 | v56.77,40.39 63.63,40.39 64.52,41.27 U7.5
  Bottom 0.203: v15.11,12.7 21.55,12.7 22.61,13.76 22.61,21.34 v24.38,23.11 | v27.3,29.72 52.12,29.72 56.36,33.96 56.36,39.98 v56.77,40.39 56.77,45.34 TP10.1
ESP_36/V_OUT  (via drill 0.3)
  Top 0.203: U3.4 11.35,9.95 v11.3,9.91 | v64.9,34.16 64.9,34.87 U11.5
  Bottom 0.203: v11.3,9.91 11.3,12.32 12.7,13.72 | 12.7,13.72 20.5,13.72 21.39,14.61 21.39,22.15 27.69,28.45 49.66,28.45 50.04,28.83 54.74,28.83 56.39,30.48 58.04,30.48 60.71,33.15 63.5,33.15 63.63,33.15 63.88,33.15 v64.9,34.16 | 12.7,13.72 TP11.1
ESP_39/W_OUT  (via drill 0.3)
  Top 0.203: U3.5 12.62,12.4 11.43,13.59 v11.35,13.59 | v14.61,26.29 v14.61,27.43 | U10.5 73.66,38.73 72.9,37.97 v69.09,37.97 | v49.78,33.78 53.98,33.78 v57.15,36.96
  Bottom 0.203: TP12.1 16,27.94 15.49,27.43 v14.61,27.43 14.61,32.13 18.03,35.56 21.21,35.56 22.99,33.78 v49.78,33.78 | v11.35,13.59 10.79,14.15 10.79,25.02 12.06,26.29 v14.61,26.29 | v69.09,37.97 66.29,37.97 65.28,36.96 v57.15,36.96
FB
  pour Top (isolate 0.203, no thermals): 40.13,42.04 40.13,42.67 40.13,42.8 40.51,43.18 40.64,43.31 42.29,43.31 45.85,43.31 45.85,41.91 41.78,41.91 41.15,42.55 41.15,42.67 41.02,42.8 40.77,42.8 40.51,42.8 40.39,42.67 40.26,42.55 40.26,42.04
GND  (via drill 0.3)
  Top 0.203: 63.9,52.94 U1.PAD 63.37,53.34 | 63.37,53.34 U1.8 60.85,53.34 v60.71,53.19 60.83,53.19 61.09,52.94 U1.9 62.97,52.94 63.37,53.34 | 63.9,51.69 U1.14 63.9,52.72 v64.01,52.83 | J1.GND2 7.57,37.41 7.62,37.47 8.38,37.47 | U6.P$4 41.53,41.45 v41.53,40.89
  Top 0.305: U6.P$4 40.65,41.79 40.64,41.78
  other vias: 11.68,22.86 13.97,22.86 16.51,22.86 19.05,22.86 19.05,15.88 16.51,15.75 13.97,15.24 11.43,15.24 19.05,20.32 19.05,17.78 7.62,31.11 35.56,59.69 38.1,59.69 3.81,50.8 33.02,59.69 33.66,25.91 48.26,52.07 45.72,12.7 7.49,27.94 6.6,15.24 6.6,19.05 6.6,24.13 41.91,59.69 82.55,26.67 33.02,55.88 2.54,40.64 0.89,40.64 69.09,14.1 70.36,14.99 72.64,60.2 55.88,52.45 61.85,60.33 27.69,49.53 27.94,2.54 4.19,8.26 5.08,5.08 1.27,7.62 28.32,9.78 63.37,60.33 72.39,54.23 28.32,11.81 34.54,9.65 26.8,14.61 34.54,17.27 28.96,17.14 25.4,44.45 23.11,45.97 37.34,34.54 59.69,59.69 82.55,54.61 7.62,19.05 77.47,59.69 54.61,3.81 53.34,7.62 83.82,6.35 19.05,25.4 16.51,25.4 58.42,1.27 57.15,59.69 53.34,59.69 45.34,45.72 35.56,52.07 17.14,45.72 63.5,53.34 62.99,52.83 64.01,53.85 62.99,53.85 44.7,34.29 35.69,39.12 8.26,35.56 53.21,51.69 61.72,48.26 33.02,43.56 36.83,19.05 46.99,17.78 12.7,46.99 10.16,46.99 13.97,6.35 11.43,6.35 13.97,8.89 19.05,6.35 41.91,17.02 31.24,34.29 35.69,41.66 45.47,40.77 3.81,46.99 82.55,31.75 57.15,39.37 82.55,40.64 82.55,44.45 46.99,24.13 43.18,26.67 26.67,12.7 52.58,46.48 52.7,43.18 52.58,39.37 77.47,31.75 57.15,37.72 76.2,55.24 80.01,36.83 63.5,37.59 72.39,33.15 58.17,43.81 36.2,44.58 7.49,12.57 11.81,18.8 62.23,43.81 73.66,41.27 71.12,41.27 71.63,48.26 38.23,45.09 35.56,12.7 41.91,10.67 59.69,56.52 53.34,25.4 10.16,58.42 15.24,58.42 20.32,58.42 72.39,38.73 58.17,41.27 64.77,48.26 59.05,34.04 77.6,42.67 62.23,41.15 57.66,34.29 72.39,37.34 68.45,40.89 68.58,35.18 82.55,36.83 66.8,45.59
  pour Top (isolate 0.305, rank 3): 0,0 85.09,0 85.09,60.96 0,60.96 0,31.75 6.1,31.75 6.1,8.89 0,8.89
  pour Bottom (isolate 0.305, rank 2): 0,0 85.09,0 85.09,60.96 0,60.96 0,31.75 6.1,31.75 6.1,8.89 0,8.89
  pour Route2 (isolate 0.305): 6.1,8.89 0,8.89 0,0 85.09,0 85.09,60.96 0,60.96 0,31.75 6.1,31.75
MOTOR_EN  (via drill 0.3)
  Top 0.203: U6.P$2 39.74,41.66 v40.01,41.4 | v36.45,34.29 36.45,28.96 v40.01,25.4 | J5.1 30.48,1.4 30.99,0.89 v39.37,0.89
  Bottom 0.203: v40.01,41.4 40.01,38.35 36.45,34.8 v36.45,34.29 | v40.01,25.4 40.01,15.75 43.31,12.45 44.58,12.45 45.59,11.43 45.59,4.32 44.45,3.17 44.45,1.91 43.43,0.89 v39.37,0.89
N$1
  Top 0.203: J1.A5 7.28,41.89 8.17,42.78 9.34,42.78 R19.2
N$2
  Top 0.203: C5.1 13.21,43.09 13.21,40.38 13.58,40.01 U4.4
N$3  (via drill 0.3)
  Top 0.203: v7.37,36.58 7.37,34.46 R18.2 | v7.37,38.86 6.29,38.86 J1.B5
  Bottom 0.203: v7.37,36.58 v7.37,38.86
N$4
  Top 0.203: U1.2 63.92,54.76 63.92,55.89 65.6,57.57 C2.2
N$6
  Top 0.381: U2.3 45.65,32.99 R24.1
N$7
  Top 0.203: Q2.5 23.24,40.64 23.11,40.77 23.11,41.66 23.71,42.25 R2.1
N$8
  Top 0.203: R3.1 23.75,38.14 23.75,39.12 22.86,40.01 22.86,40.26 22.48,40.64 Q2.2
N$9
  Top 0.203: R17.1 24.52,48.03 D2.A
N$11  (via drill 0.3)
  Top 0.203: R28.2 39.75,8.93 39.75,9.65 40.01,9.91 46.35,9.91 46.99,10.54 v46.99,11.81
  Bottom 0.203: v46.99,11.81 46.98,11.82 INT.1
N$12  (via drill 0.3)
  Top 0.203: R26.2 39.37,53.72 v39.75,53.34
  Bottom 0.203: v39.75,53.34 I2C.3
N$13  (via drill 0.3)
  Top 0.203: R27.2 37.68,57.95 v37.34,58.29
  Bottom 0.203: v37.34,58.29 38.86,58.29 39.75,57.4 I2C.1
N$14
  Top 0.203: R21.1 76.2,33.23 R20.2 76.2,34.8 74.14,36.86 U9.4
N$15  (via drill 0.3)
  Top 0.203: R17.2 v27.3,48.01
  Bottom 0.203: v27.3,48.01 26.67,48.64 PWR.1
N$17  (via drill 0.3)
  Top 0.381: C11.1 v31.75,39.24 31.77,39.22 F1.1 31.63,36.84 31.62,36.83 MEAS.4
  Bottom 0.381: MEAS.2 MEAS.4 | v31.75,39.24 BYP.1
N$21
  Top 0.305: Q1.3 28.81,45.96 29.34,46.48 33.02,46.48 33.91,45.59 33.91,43.05 33.27,42.42 31.5,42.42 31.37,42.29 31.37,41.53
  Top 0.381: R4.2 31.37,41.53 30.43,41.53 Q3.1
N$22
  Top 0.381: Q1.5 Q1.2 Q1.1 31.95,45.12 R1.2
N$26
  Top 0.305: D1.A 30.87,48.03 R22.1
N$27  (via drill 0.3)
  Top 0.305: v33.66,48.9 33.66,48.3 33.36,48.01 R22.2
  Bottom 0.305: v33.66,48.9 33.02,48.26 MPWR.1
N$29
  Top 0.203: D4.C 54.19,49.38 R13.2
N$33
  Top 0.305: D5.C 52.46,54 R15.2
RTS
  Top 0.203: R3.2 21.94,38.17 21.94,39.37 | 21.94,39.37 Q2.3 | 21.94,39.37 19.05,39.37 18.67,39.75 18.67,41.02 18.92,41.27 U4.14
S  (via drill 0.3)
  Top 0.203: D4.A 52.46,51.8 v52.45,51.82
  Bottom 0.203: v52.45,51.82 52.45,52.69 !STBY.1
SENSE  (via drill 0.3)
  Top 0.305: U1.16 65.06,52.54 v66.04,51.56 | U1.20 65.48,54.14 65.66,54.32 v66.04,54.32
  Top 0.381: v74.14,34.26 U9.3
  Top 0.508: v68.33,59.31 R14.2
  Bottom 0.381: v68.33,59.31 74.55,59.31 78.99,54.86 78.99,39.12 v74.14,34.26
  Bottom 0.508: v66.04,51.56 v66.04,54.32 66.04,57.02 v68.33,59.31
SENSE_U
  Top 0.203: U1.15 64.3,51.22 64.26,51.18
  Top 0.381: R32.1 70.02,49.66 70.02,49.19 68.58,47.75 65.66,47.75 64.95,47.05 U7.8
  pour Top (isolate 0.305, no thermals): 64.14,52.2 64.14,50.8 65.28,49.66 69.98,49.66 69.98,50.67 66.17,50.67 64.64,52.2
SENSE_V  (via drill 0.3)
  Top 0.203: U1.17 65.93,52.94 66.67,52.2
  Top 0.381: v65.02,39.5 65.02,38.8 U11.8 | R33.1 70.1,52.11 v70.1,51.31
  Bottom 0.381: v70.1,51.31 70.1,44.58 v65.02,39.5
  pour Top (isolate 0.305, no thermals): 64.64,52.96 64.64,52.83 65.79,52.83 66.42,52.2 66.42,52.07 70.1,52.07 70.1,52.96
SENSE_W  (via drill 0.3)
  Top 0.254: U1.1 64.3,55.54 64.77,56.01 65.15,56.01
  Top 0.381: R34.1 70.1,57.32 v70.1,56.77 | v75.06,45.59 75.06,42.6 U10.8
  Bottom 0.381: v70.1,56.77 70.1,57.02 70.48,57.4 71.25,57.4 75.06,53.59 v75.06,45.59
  pour Top (isolate 0.305, no thermals): 64.26,54.48 64.26,55.63 66.93,58.29 70.23,58.29 70.23,57.28 68.96,57.28 66.17,54.48
SHLD
  Top 0.203: J1.SHLD1 J1.SHLD3 J1.SHLD4
  Bottom 0.203: J1.SHLD4 1.52,36.34 SHLD.2 5.68,36.34 J1.SHLD2
SW
  Top 0.305: U6.P$7 39.74,44.95 39.75,44.96
  pour Top (isolate 0.152, no thermals): 37.72,43.31 37.72,43.05 39.37,43.05 39.88,43.56 39.88,43.94 39.88,44.96 40.01,45.09 40.26,45.34 40.26,45.59 40.26,46.35 40.39,46.48 40.51,46.61 41.53,46.61 41.91,46.61 42.04,46.74 42.04,47.88 41.78,48.13 41.66,48.26 39.37,48.26 38.35,48.26 37.97,47.88 37.97,46.74 38.1,46.61 38.48,46.61 38.73,46.61 39.12,46.23 39.12,46.1 39.12,45.21 39.24,45.09 39.5,44.83 39.62,44.7 39.62,44.32 39.62,43.69 39.62,43.56 39.37,43.31
TP2  (via drill 0.3)
  Top 0.203: STAT.DO 35.98,27.39 v36.45,26.92
  Bottom 0.203: v36.45,26.92 36.83,26.54 TP2.1
U  (via drill 0.3)
  Top 0.381: R32.2 70.57,49.53 70.57,48.98 68.71,47.12 v66.04,47.12 | v60.83,47.12 59.56,45.85 59.56,45.14 U7.1
  Bottom 0.381: v60.83,47.12 v66.04,47.12 66.04,47.75 66.55,48.26 TP13.1
  pour Top (isolate 0.305, no thermals): 70.74,50.67 70.74,49.66 73.79,49.66 74.17,50.04 77.85,50.04 77.85,51.56 77.6,51.82 72.9,51.82 71.75,50.67
V  (via drill 0.3)
  Top 0.381: R33.2 71.12,52.58 70.86,52.32 v70.86,51.3 | U11.1 59.12,38.73 58.36,39.5 v58.29,39.5
  Bottom 0.381: v70.86,51.3 v70.87,51.3 70.87,44.32 65.44,38.9 64.48,38.9 63.88,39.5 v58.29,39.5 58.29,38.99 58.42,38.86 TP14.1
  pour Top (isolate 0.305, no thermals): 70.74,52.2 77.85,52.2 78.23,51.82 78.23,50.04 79.25,50.04 79.25,52.7 78.61,53.34 72.9,53.34 72.64,53.09 70.74,53.09
V_USB  (via drill 0.3)
  Top 0.381: U5.5 v9.91,40.64 | C6.1 C7.+ 9.53,37.72 9.05,38.19 J1.VBUS2 6.16,38.3 5.76,38.3 4.7,39.36 v4.7,40.64 4.7,41.92 5.76,42.98 6.16,42.98 J1.VBUS1 7.2,43.09 v7.24,43.05 | Q1.6 30.11,42.69 v30.1,42.67 | Q3.3 29.42,39.37 v28.45,39.37
  other vias: 10.54,36.45
  pour Route15 (isolate 0.305): 3.81,39.12 4.45,38.48 5.46,38.48 6.73,37.21 7.75,37.21 9.4,35.56 21.84,35.56 24.38,38.1 30.23,38.1 30.61,38.48 30.61,43.81 30.48,43.94 29.46,43.94 26.67,41.15 24.89,41.15 21.08,37.34 11.18,37.34 11.18,40.77 7.62,44.32 6.73,44.32 3.81,41.4
W  (via drill 0.3)
  Top 0.381: v74.17,45.34 73.66,45.34 70.87,42.55 U10.1 | R34.2 70.87,57.32 v70.87,56.77
  Bottom 0.381: v70.87,56.77 74.17,53.47 v74.17,45.34 74.93,44.58 TP15.1
  pour Top (isolate 0.305, no thermals): 70.87,57.28 76.07,57.28 79.63,53.72 79.63,50.04 80.39,50.04 80.39,54.86 76.96,58.29 70.87,58.29

## Text on the board
Bottom: v10
Milling: ROUTE OUT | ROUTE OUT | ROUTE OUT
Measures: Units in inches
tDocu: 1.6mm Thickness / 4-Layer / 1oz copper outer / 0.5oz copper inner / Lead Free HASL | M. Chodikov